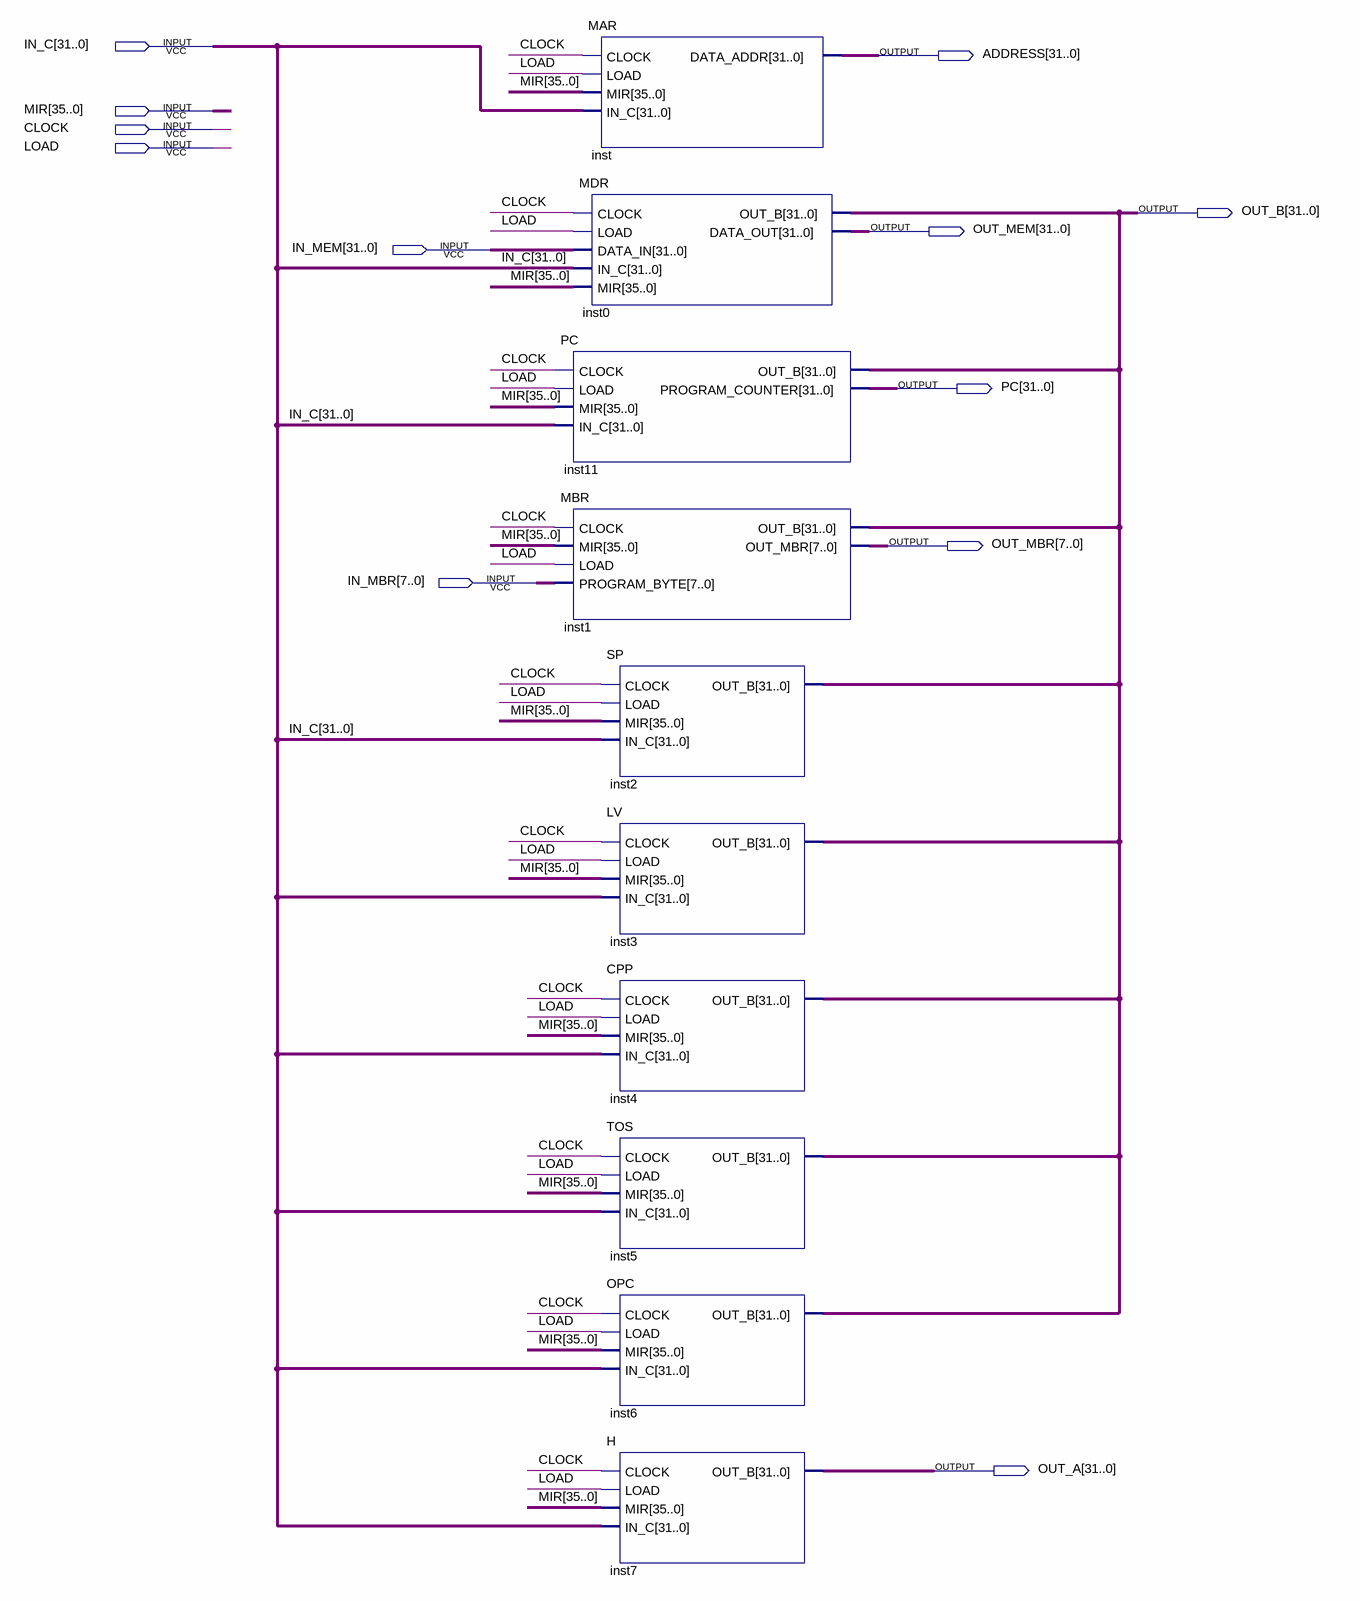
[diagram p0: schematic sheet]
// Quartus schematic BANK_REGS.bdf as structural Verilog: 10 symbols, 12 pins
module BANK_REGS (
  input  [31:0] IN_C,
  input  [35:0] MIR,
  input  CLOCK,
  input  LOAD,
  input  [31:0] IN_MEM,
  input  [7:0] IN_MBR,
  output [31:0] ADDRESS,
  output [31:0] OUT_B,
  output [31:0] OUT_MEM,
  output [31:0] PC,
  output [7:0] OUT_MBR,
  output [31:0] OUT_A
);

  PC inst11 (.CLOCK(CLOCK), .LOAD(LOAD), .MIR(MIR), .IN_C(IN_C), .OUT_B(OUT_B), .PROGRAM_COUNTER(PC));
  MBR inst1 (.CLOCK(CLOCK), .MIR(MIR), .LOAD(LOAD), .PROGRAM_BYTE(IN_MBR), .OUT_B(OUT_B), .OUT_MBR(OUT_MBR));
  MAR inst (.CLOCK(CLOCK), .LOAD(LOAD), .MIR(MIR), .IN_C(IN_C), .DATA_ADDR(ADDRESS));
  MDR inst0 (.CLOCK(CLOCK), .LOAD(LOAD), .DATA_IN(IN_MEM), .IN_C(IN_C), .MIR(MIR), .OUT_B(OUT_B), .DATA_OUT(OUT_MEM));
  SP inst2 (.CLOCK(CLOCK), .LOAD(LOAD), .MIR(MIR), .IN_C(IN_C), .OUT_B(OUT_B));
  LV inst3 (.CLOCK(CLOCK), .LOAD(LOAD), .MIR(MIR), .IN_C(IN_C), .OUT_B(OUT_B));
  CPP inst4 (.CLOCK(CLOCK), .LOAD(LOAD), .MIR(MIR), .IN_C(IN_C), .OUT_B(OUT_B));
  TOS inst5 (.CLOCK(CLOCK), .LOAD(LOAD), .MIR(MIR), .IN_C(IN_C), .OUT_B(OUT_B));
  OPC inst6 (.CLOCK(CLOCK), .LOAD(LOAD), .MIR(MIR), .IN_C(IN_C), .OUT_B(OUT_B));
  H inst7 (.CLOCK(CLOCK), .LOAD(LOAD), .MIR(MIR), .IN_C(IN_C), .OUT_B(OUT_A));
endmodule
